# Altium schematic sheet Sync Out.SchDoc
size 297 x 209 mm; SheetNumber: 23; SheetTotal: 29
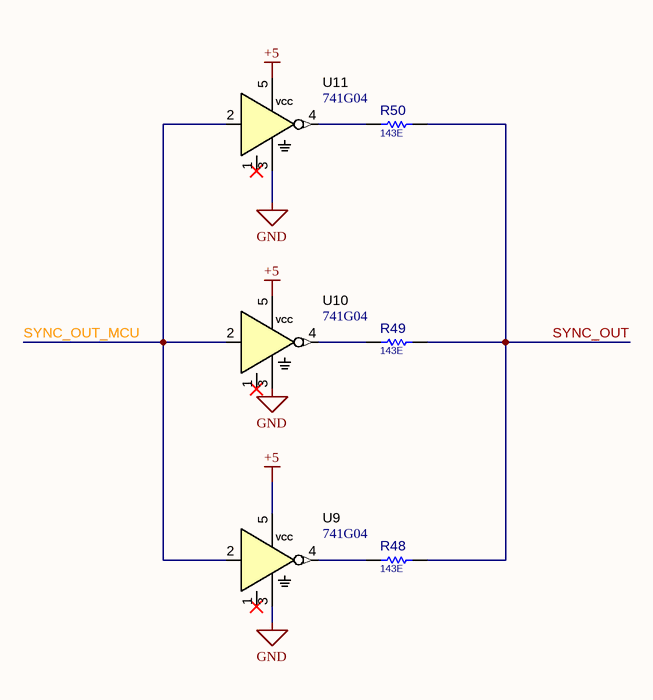
[diagram p0: Sync Out.SchDoc]

## Parts
R48  143E  [R0603]
R49  143E  [R0603]
R50  143E  [R0603]
U9  741G04  [SOT353_5]
U10  741G04  [SOT353_5]
U11  741G04  [SOT353_5]

## Nets
+5: U9.5(VCC) U10.5(VCC) U11.5(VCC)
GND: U9.3(GND) U10.3(GND) U11.3(GND)
SYNC_OUT: R48.2 R49.2 R50.2
SYNC_OUT_MCU: U9.2(A) U10.2(A) U11.2(A)
NetR48_1: R48.1 U9.4(Y)
NetR49_1: R49.1 U10.4(Y)
NetR50_1: R50.1 U11.4(Y)

Not connected (* = marked no-connect by the designer): U9 1(NC)*; U10 1(NC)*; U11 1(NC)*

## Notes on the sheet
- Drawn
- Name
- Date
- Drawing Title
- Checked
- Drawing No.
- Approved
- Size
- A4
- Ver.
- Rev.
- Sheet
- Of

## Library data of the parts
R48-R50 = RES_SMD_0603: RESISTOR, SMD; PARAM: -W; DESC: DESCRIPTION; DIST#: MOUSER; PARAM2: 1%; MANF_P#: -; MANF: -; ASSEMBLY: ASSEMBLY; PRICE: 100= 0.5$; VALUE: 143E
U9-U11 = NOT_SN74LVC1G04_SOT353: GATE, NOT, SINGLE, SOT353 SMD; MANF: Texas Instruments; MANF_P#: SN74LVC1GU04DCK; PARAM2: 2~5.5V; VALUE: 741G04